# EAGLE schematic rpi-management (EAGLE 7.2.0)
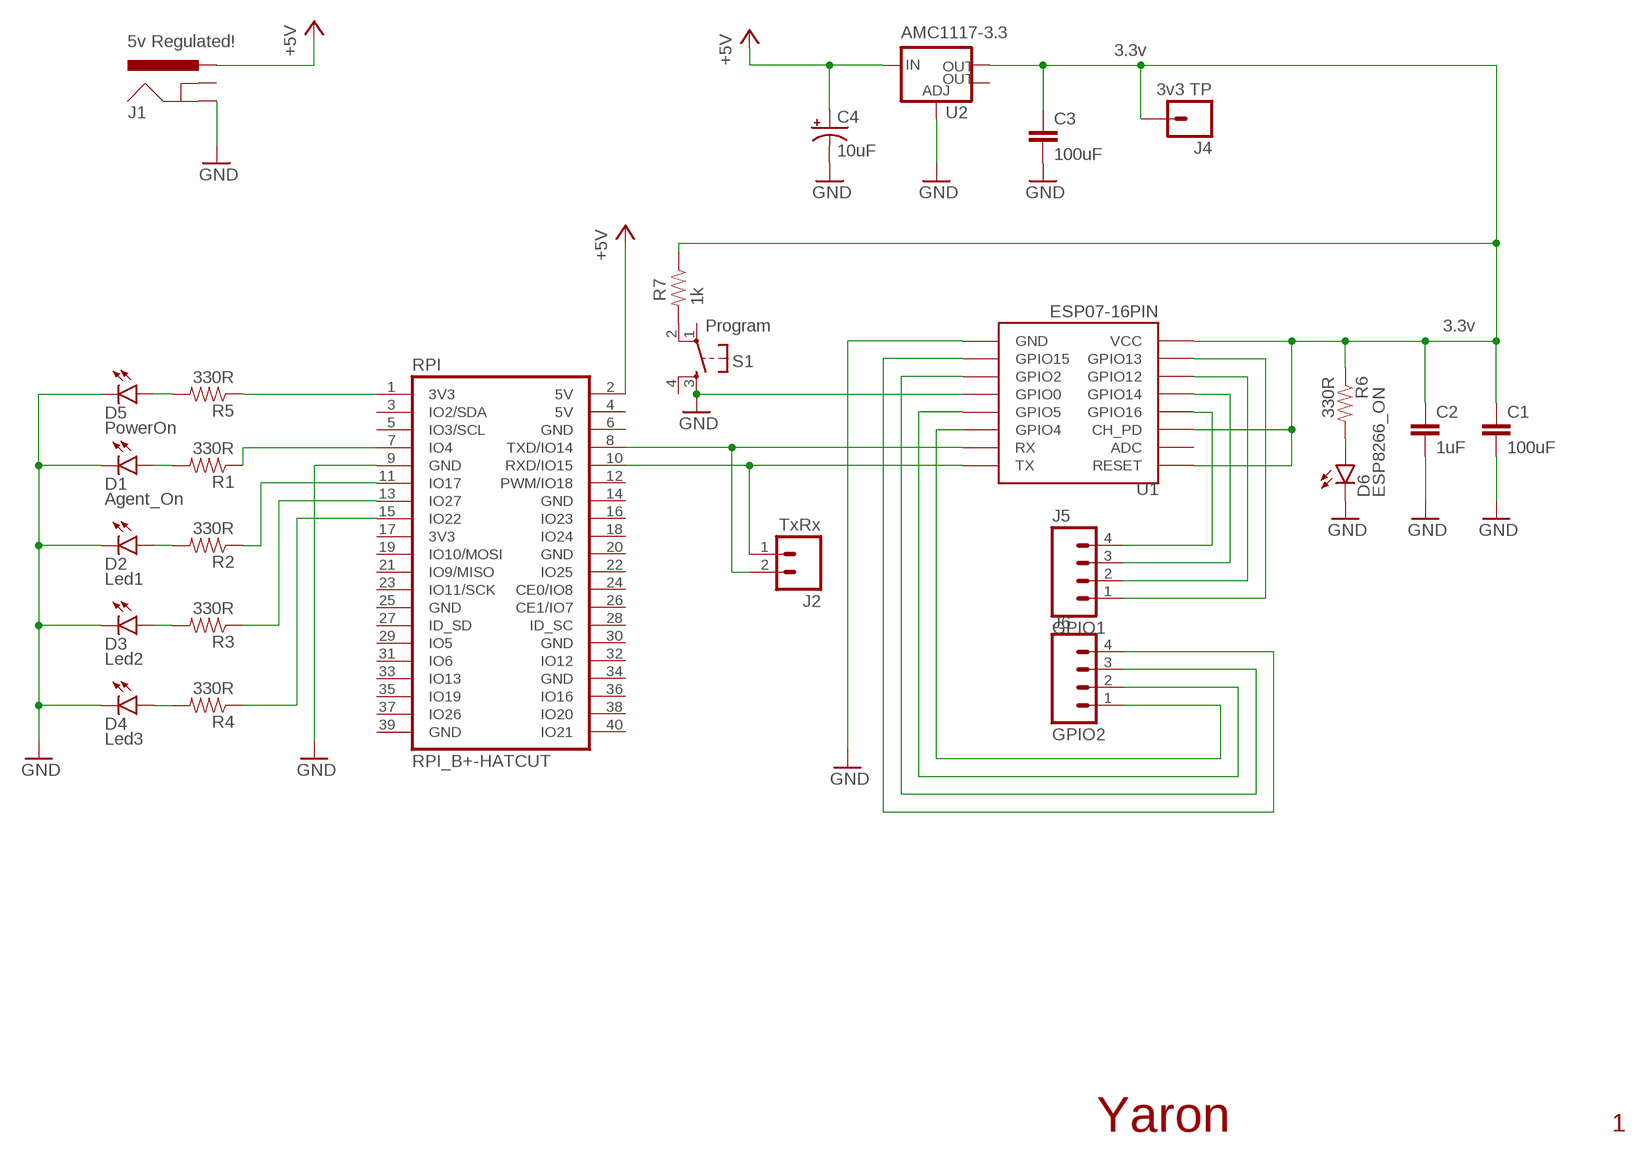
[diagram p0: schematic, sheet 1]

## Parts
C1  100uF  CAP0603-CAP  [0603-CAP]
C2  1uF  CAP0603-CAP  [0603-CAP]
C3  100uF  CAP0603-CAP  [0603-CAP]
C4  10uF  CAP_POL6032  [EIA6032]
D1  Agent_On  LED0603  [LED-0603]
D2  Led1  LED0603  [LED-0603]
D3  Led2  LED0603  [LED-0603]
D4  Led3  LED0603  [LED-0603]
D5  PowerOn  LED0603  [LED-0603]
D6  ESP8266_ON  LED0603  [LED-0603]
J1  5v Regulated!  POWER_JACKSLT  [POWER_JACK_SLOT]
J2  TxRx  M02PTH  [1X02]
J4  3v3 TP  M01PTH  [1X01]
J5  GPIO1  M04PTH  [1X04]
J6  GPIO2  M04PTH  [1X04]
R1  330R  RESISTOR0603-RES  [0603-RES]
R2  330R  RESISTOR0603-RES  [0603-RES]
R3  330R  RESISTOR0603-RES  [0603-RES]
R4  330R  RESISTOR0603-RES  [0603-RES]
R5  330R  RESISTOR0603-RES  [0603-RES]
R6  330R  RESISTOR0603-RES  [0603-RES]
R7  1k  RESISTOR0603-RES  [0603-RES]
RPI  RPI_B+-HATCUT  [RPI-B+HAT_CUTOUT]
S1  Program  TAC_SWITCHPTH  [TACTILE-PTH]
U1  ESP07-16PIN  [ESP07-16PIN]
U2  AMC1117-3.3  V_REG_LM1117SOT223  [SOT223]

## Nets
+5V: C4.P$1(+) J1.PWR RPI.2(5V) U2.3(IN)
GND: C1.2 C2.2 C3.2 C4.P$2(-) D1.C D2.C D3.C D4.C D5.C D6.C J1.GND@2(GND) RPI.9(GND) S1.3 U1.GND U1.GPIO0 U2.1(ADJ)
N$1: D1.A R1.2
N$2: D2.A R2.2
N$3: D3.A R3.2
N$4: D4.A R4.2
N$5: D5.A R5.2
N$6: R1.1 RPI.7(IO4)
N$7: R2.1 RPI.11(IO17)
N$8: R3.1 RPI.13(IO27)
N$9: R4.1 RPI.15(IO22)
N$10: R5.1 RPI.1(3V3)
N$11: J2.1 RPI.10(RXD/IO15) U1.TX
N$12: J2.2 RPI.8(TXD/IO14) U1.RX
N$13: R7.2 S1.2
N$14: J5.4 U1.GPIO16
N$15: D6.A R6.2
N$16: C1.1 C2.1 C3.1 J4.1 R6.1 R7.1 U1.CH_PD U1.REST(RESET) U1.VCC U2.2(OUT)
N$19: J5.3 U1.GPIO14
N$20: J5.2 U1.GPIO12
N$21: J5.1 U1.GPIO13
N$22: J6.1 U1.GPIO4
N$25: J6.3 U1.GPIO2
N$26: J6.4 U1.GPIO15
N$27: J6.2 U1.GPIO5
Unconnected: J1.GND@1(GNDBREAK) RPI.3(IO2/SDA) RPI.4(5V) RPI.5(IO3/SCL) RPI.6(GND) RPI.12(PWM/IO18) RPI.14(GND) RPI.16(IO23) RPI.17(3V3) RPI.18(IO24) RPI.19(IO10/MOSI) RPI.20(GND) RPI.21(IO9/MISO) RPI.22(IO25) RPI.23(IO11/SCK) RPI.24(CE0/IO8) RPI.25(GND) RPI.26(CE1/IO7) RPI.27(ID_SD) RPI.28(ID_SC) RPI.29(IO5) RPI.30(GND) RPI.31(IO6) RPI.32(IO12) RPI.33(IO13) RPI.34(GND) RPI.35(IO19) RPI.36(IO16) RPI.37(IO26) RPI.38(IO20) RPI.39(GND) RPI.40(IO21) S1.1 S1.4 U1.ADC U2.4(OUT)

## Notes on the sheet
- 3.3v
- 3.3v
- Yaron | 1

## Library data of the parts
C1-C3 = SparkFun-Capacitors:CAP: Capacitor Standard 0603 ceramic capacitor, and 0.1" leaded capacitor.
C4 = SparkFun-Passives:CAP_POL: Capacitor Polarized These are standard SMD and PTH capacitors. Normally 10uF, 47uF, and 100uF in electrolytic and tantalum varieties. Always verify the external diameter of the through hole cap, it varies with capacity, voltage, and manufacturer. The EIA devices should be standard.
D1-D6 = SparkFun-LED:LED: LEDs Standard schematic elements and footprints for 5mm, 3mm, 1206, and 0603 sized LEDs. 5mm - Spark Fun Electronics SKU : COM-00529 (and others)
J1 = SparkFun-Connectors:POWER_JACK: Power Jack This is the standard 5.5mm barrel jack for power. The PTH is the most common, proven, reliable, footprint. The Slot footprint only works if the mill layer is transmitted to the PCB fab house so be warned. Mating wall wart : TOL-00298 (and others); PROD_ID: PRT-00119
J2 = SparkFun-Connectors:M02: Standard 2-pin 0.1" header. Use with - straight break away headers ( PRT-00116) - right angle break away headers (PRT-00553) - swiss pins (PRT-00743) - machine pins (PRT-00117) - female headers (PRT-00115) Molex polarized connector foot print use with: PRT-08233 with associated crimp pins and housings. 2.54_SCREWTERM for use with PRT-10571. 3.5mm Screw Terminal footprints for PRT-08084 5mm Screw Terminal footprints for use with PRT-08432
J4 = SparkFun-Connectors:M01: Header 1 Standard 1-pin 0.1" header. Use with straight break away headers (SKU : PRT-00116), right angle break away headers (PRT-00553), swiss pins (PRT-00743), machine pins (PRT-00117), and female headers (PRT-00115). SMTSO-256-ET is a "flush mount" nut for a 4-40 screw. The older package used to be too tight, and did not allow it to sit properly thru the drill hit. The latest (0.165DIA) fits nice and snug.
J5 J6 = SparkFun-Connectors:M04: Header 4 Standard 4-pin 0.1" header. Use with straight break away headers (SKU : PRT-00116), right angle break away headers (PRT-00553), swiss pins (PRT-00743), machine pins (PRT-00117), and female headers (PRT-00115). Molex polarized connector foot print use with SKU : PRT-08231 with associated crimp pins and housings. 1MM SMD Version SKU: PRT-10208; PROD_ID: CONN-09696
R1-R7 = SparkFun-Passives:RESISTOR: Resistor Basic schematic elements and footprints for 0603, 1206, and PTH resistors.
RPI = we-board:RPI_B+: Raspberry Pi Model B+
S1 = SparkFun-Retired:TAC_SWITCH: Momentary Switch Button commonly used for reset or general input. Spark Fun Electronics SKU : COM-00097 SMT- SWCH-08247
U1 = esp8266modules:ESP07-16PIN: ESP8266 Wifi module 07 - 16 pins; DIMENSIONS: 22.0 x 16.0 mm; PINS: 16; PITCH: 0.078" / 2 mm
U2 = SparkFun-PowerIC:V_REG_LM1117: Voltage Regulator LM1117 Standard adjustable voltage regulator but in SMD form. Spark Fun Electronics SKU : COM-00595; PROD_ID: VREG-08170